# EAGLE schematic board (EAGLE 9.6.2)
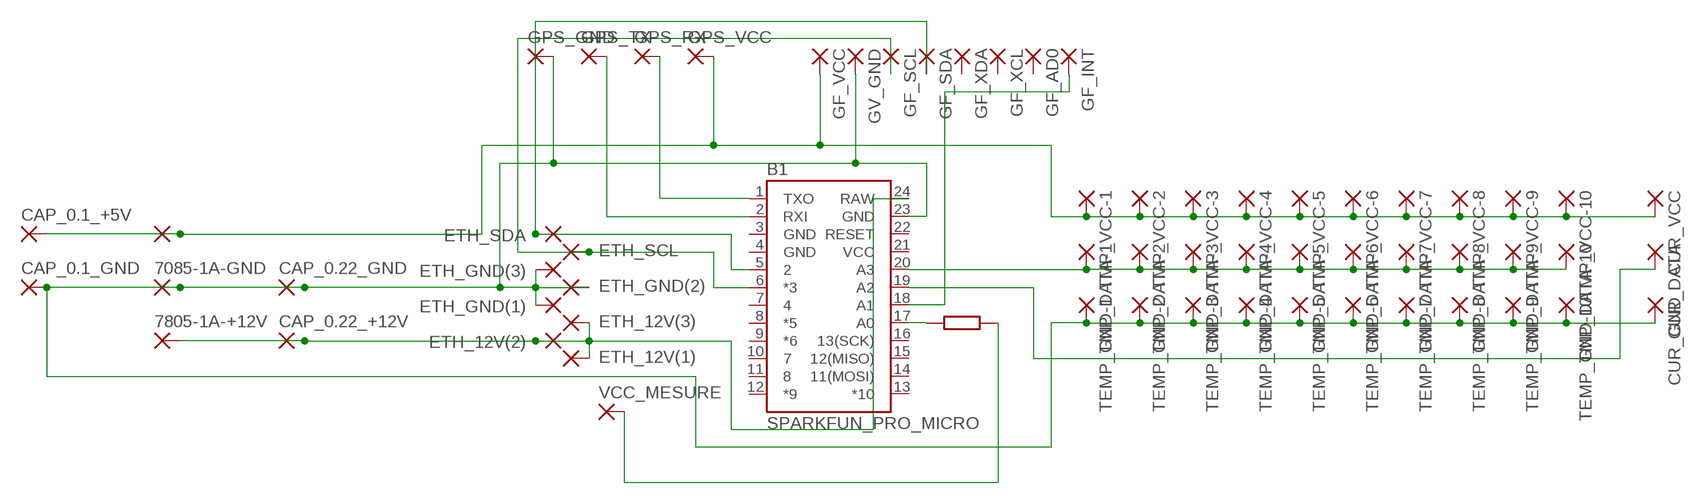
[diagram p0: schematic, sheet 1]

## Parts
7085-1A-GND  2,15/1,0  [2,15/1,0]
7805-1A-+5V  2,15/1,0  [2,15/1,0]
7805-1A-+12V  2,15/1,0  [2,15/1,0]
B1  SPARKFUN_PRO_MICRO  [SPARKFUN_PRO_MICRO]
CAP_0.1_+5V  2,15/1,0  [2,15/1,0]
CAP_0.1_GND  2,15/1,0  [2,15/1,0]
CAP_0.22_+12V  2,15/1,0  [2,15/1,0]
CAP_0.22_GND  2,15/1,0  [2,15/1,0]
CUR_DATA  2,15/1,0  [2,15/1,0]
CUR_GND  2,15/1,0  [2,15/1,0]
CUR_VCC  2,15/1,0  [2,15/1,0]
ETH_12V(1)  2,15/1,0  [2,15/1,0]
ETH_12V(2)  2,15/1,0  [2,15/1,0]
ETH_12V(3)  2,15/1,0  [2,15/1,0]
ETH_GND(1)  2,15/1,0  [2,15/1,0]
ETH_GND(2)  2,15/1,0  [2,15/1,0]
ETH_GND(3)  2,15/1,0  [2,15/1,0]
ETH_SCL  2,15/1,0  [2,15/1,0]
ETH_SDA  2,15/1,0  [2,15/1,0]
GF_AD0  2,15/1,0  [2,15/1,0]
GF_INT  2,15/1,0  [2,15/1,0]
GF_SCL  2,15/1,0  [2,15/1,0]
GF_SDA  2,15/1,0  [2,15/1,0]
GF_VCC  2,15/1,0  [2,15/1,0]
GF_XCL  2,15/1,0  [2,15/1,0]
GF_XDA  2,15/1,0  [2,15/1,0]
GPS_GND  2,15/1,0  [2,15/1,0]
GPS_RX  2,15/1,0  [2,15/1,0]
GPS_TX  2,15/1,0  [2,15/1,0]
GPS_VCC  2,15/1,0  [2,15/1,0]
GV_GND  2,15/1,0  [2,15/1,0]
TEMP_GND-1  2,15/1,0  [2,15/1,0]
TEMP_GND-2  2,15/1,0  [2,15/1,0]
TEMP_GND-3  2,15/1,0  [2,15/1,0]
TEMP_GND-4  2,15/1,0  [2,15/1,0]
TEMP_GND-5  2,15/1,0  [2,15/1,0]
TEMP_GND-6  2,15/1,0  [2,15/1,0]
TEMP_GND-7  2,15/1,0  [2,15/1,0]
TEMP_GND-8  2,15/1,0  [2,15/1,0]
TEMP_GND-9  2,15/1,0  [2,15/1,0]
TEMP_GND-10  2,15/1,0  [2,15/1,0]
TMP_DATA-1  2,15/1,0  [2,15/1,0]
TMP_DATA-2  2,15/1,0  [2,15/1,0]
TMP_DATA-3  2,15/1,0  [2,15/1,0]
TMP_DATA-4  2,15/1,0  [2,15/1,0]
TMP_DATA-5  2,15/1,0  [2,15/1,0]
TMP_DATA-6  2,15/1,0  [2,15/1,0]
TMP_DATA-7  2,15/1,0  [2,15/1,0]
TMP_DATA-8  2,15/1,0  [2,15/1,0]
TMP_DATA-9  2,15/1,0  [2,15/1,0]
TMP_DATA-10  2,15/1,0  [2,15/1,0]
TMP_VCC-1  2,15/1,0  [2,15/1,0]
TMP_VCC-2  2,15/1,0  [2,15/1,0]
TMP_VCC-3  2,15/1,0  [2,15/1,0]
TMP_VCC-4  2,15/1,0  [2,15/1,0]
TMP_VCC-5  2,15/1,0  [2,15/1,0]
TMP_VCC-6  2,15/1,0  [2,15/1,0]
TMP_VCC-7  2,15/1,0  [2,15/1,0]
TMP_VCC-8  2,15/1,0  [2,15/1,0]
TMP_VCC-9  2,15/1,0  [2,15/1,0]
TMP_VCC-10  2,15/1,0  [2,15/1,0]
VCC_MESURE  2,15/1,0  [2,15/1,0]

## Nets
N$1: B1.5 ETH_SDA.1(P) GF_SDA.1(P)
N$2: B1.6(*3) ETH_SCL.1(P) GF_SCL.1(P)
N$3: B1.19(A2) CUR_DATA.1(P)
N$4: B1.17(A0)
N$5: 7805-1A-+12V.1(P) B1.24(RAW) CAP_0.22_+12V.1(P) ETH_12V(1).1(P) ETH_12V(2).1(P) ETH_12V(3).1(P)
N$6: B1.20(A3) TMP_DATA-1.1(P) TMP_DATA-2.1(P) TMP_DATA-3.1(P) TMP_DATA-4.1(P) TMP_DATA-5.1(P) TMP_DATA-6.1(P) TMP_DATA-7.1(P) TMP_DATA-8.1(P) TMP_DATA-9.1(P) TMP_DATA-10.1(P)
N$7: 7805-1A-+5V.1(P) CAP_0.1_+5V.1(P) CUR_VCC.1(P) GF_VCC.1(P) GPS_VCC.1(P) TMP_VCC-1.1(P) TMP_VCC-2.1(P) TMP_VCC-3.1(P) TMP_VCC-4.1(P) TMP_VCC-5.1(P) TMP_VCC-6.1(P) TMP_VCC-7.1(P) TMP_VCC-8.1(P) TMP_VCC-9.1(P) TMP_VCC-10.1(P)
N$8: 7085-1A-GND.1(P) B1.23(GND) CAP_0.1_GND.1(P) CAP_0.22_GND.1(P) CUR_GND.1(P) ETH_GND(1).1(P) ETH_GND(2).1(P) ETH_GND(3).1(P) GPS_GND.1(P) GV_GND.1(P) TEMP_GND-1.1(P) TEMP_GND-2.1(P) TEMP_GND-3.1(P) TEMP_GND-4.1(P) TEMP_GND-5.1(P) TEMP_GND-6.1(P) TEMP_GND-7.1(P) TEMP_GND-8.1(P) TEMP_GND-9.1(P) TEMP_GND-10.1(P)
N$9: B1.1(TXO) GPS_RX.1(P)
N$10: B1.2(RXI) GPS_TX.1(P)
N$11: B1.18(A1) GF_INT.1(P)
N$12: VCC_MESURE.1(P)
Unconnected: B1.7 B1.8(*5) B1.9(*6) B1.10 B1.11 B1.12(*9) B1.13(*10) B1.14(11(MOSI)) B1.15(12(MISO)) B1.16(13(SCK)) B1.22(RESET) GF_AD0.1(P) GF_XCL.1(P) GF_XDA.1(P)

## Power pins joined to a net without a drawn wire
GND: B1.3(GND) B1.4(GND)
VCC: B1.21(VCC)

## Library data of the parts
7085-1A-GND 7805-1A-+5V 7805-1A-+12V CAP_0.1_+5V CAP_0.1_GND CAP_0.22_+12V CAP_0.22_GND CUR_DATA CUR_GND CUR_VCC ETH_12V(1) ETH_12V(2) ETH_12V(3) ETH_GND(1) ETH_GND(2) ETH_GND(3) ETH_SCL ETH_SDA GF_AD0 GF_INT GF_SCL GF_SDA GF_VCC GF_XCL GF_XDA GPS_GND GPS_RX GPS_TX GPS_VCC GV_GND TEMP_GND-1-TEMP_GND-10 TMP_DATA-1-TMP_DATA-10 TMP_VCC-1-TMP_VCC-10 VCC_MESURE = wirepad:2,15/1,0: THROUGH-HOLE PAD
B1 = SparkFun-Boards:SPARKFUN_PRO_MICRO: SparkFun Pro Micro Atmega32U4 compatible footprint. SparkFun Products: 3.3V/8MHz <https://www.sparkfun.com/products/12587> 5V/16MHz <https://www.sparkfun.com/products/12640>

## Net classes
0 default: width 1.25 mm, clearance 0.5 mm